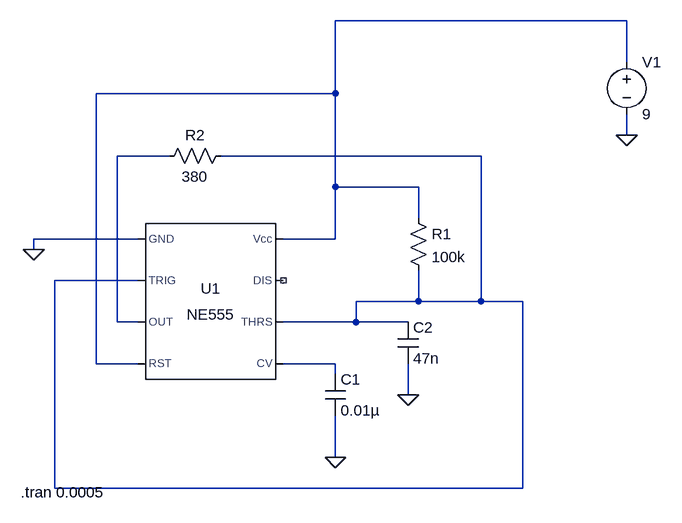
[diagram p0: schematic frequency_generator.asc]
frequency_generator.asc, the LTspice schematic file:
Version 4
SHEET 1 880 680
WIRE 544 -176 96 -176
WIRE 544 -112 544 -176
WIRE 96 -64 96 -176
WIRE 96 -64 -272 -64
WIRE 544 0 544 -32
WIRE -160 32 -240 32
WIRE 320 32 -80 32
WIRE 96 80 96 -64
WIRE 224 80 96 80
WIRE 224 128 224 80
WIRE -208 160 -368 160
WIRE 96 160 96 80
WIRE 96 160 16 160
WIRE -368 176 -368 160
WIRE -208 224 -336 224
WIRE 224 256 224 208
WIRE 224 256 128 256
WIRE 320 256 320 32
WIRE 320 256 224 256
WIRE 384 256 320 256
WIRE -240 288 -240 32
WIRE -208 288 -240 288
WIRE 128 288 128 256
WIRE 128 288 16 288
WIRE 208 288 128 288
WIRE -272 352 -272 -64
WIRE -208 352 -272 352
WIRE 96 352 16 352
WIRE 96 368 96 352
WIRE 208 400 208 352
WIRE 96 496 96 432
WIRE -336 544 -336 224
WIRE 384 544 384 256
WIRE 384 544 -336 544
FLAG -368 176 0
FLAG 96 496 0
FLAG 208 400 0
FLAG 544 0 0
SYMBOL Misc\\NE555 -96 256 R0
SYMATTR InstName U1
SYMBOL cap 80 368 R0
SYMATTR InstName C1
SYMATTR Value 0.01µ
SYMBOL cap 192 288 R0
SYMATTR InstName C2
SYMATTR Value 47n
SYMBOL voltage 544 -128 R0
WINDOW 123 0 0 Left 0
WINDOW 39 0 0 Left 0
SYMATTR InstName V1
SYMATTR Value 9
SYMBOL res 208 112 R0
SYMATTR InstName R1
SYMATTR Value 100k
SYMBOL res -64 16 R90
WINDOW 0 0 56 VBottom 2
WINDOW 3 32 56 VTop 2
SYMATTR InstName R2
SYMATTR Value 380
TEXT -388 550 Left 2 !.tran 0.0005

The netlist it stands for:
* frequency_generator.asc
XU1 0 N003 N002 N001 N004 N003 NC_01 N001 NE555  ; pins GND TRIG OUT RST CV THRS DIS Vcc
C1 N004 0 0.01µ
C2 N003 0 47n
V1 N001 0 9
R1 N001 N003 100k
R2 N003 N002 380
.tran 0.0005
.lib NE555.sub
.backanno
.end